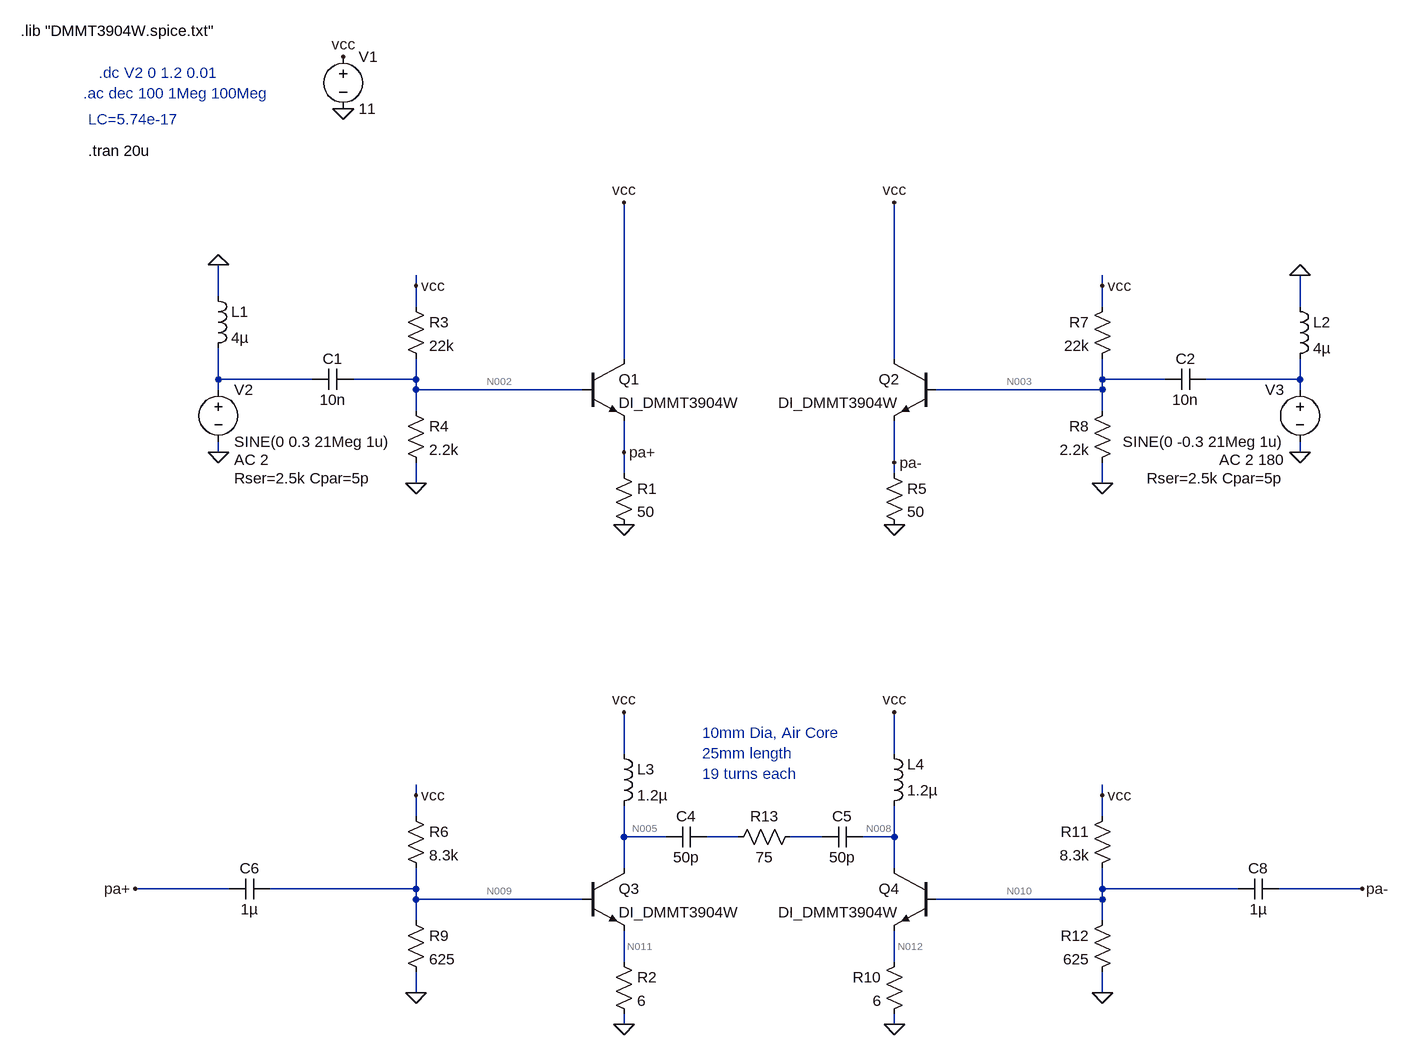
[diagram p0: schematic Output.asc]
Output.asc, the LTspice schematic file:
Version 4.1
SHEET 1 4292 2340
WIRE -128 -16 -128 -32
WIRE 928 -16 928 -32
WIRE -432 0 -432 -48
WIRE -128 16 -128 -16
WIRE 928 16 928 -16
WIRE 1232 16 1232 -32
WIRE 192 96 192 -144
WIRE 608 96 608 -144
WIRE -432 128 -432 80
WIRE -288 128 -432 128
WIRE -128 128 -128 96
WIRE -128 128 -224 128
WIRE 928 128 928 96
WIRE 1024 128 928 128
WIRE 1232 128 1232 96
WIRE 1232 128 1088 128
WIRE -432 144 -432 128
WIRE -128 144 -128 128
WIRE 128 144 -128 144
WIRE 928 144 928 128
WIRE 928 144 672 144
WIRE 1232 144 1232 128
WIRE -128 176 -128 144
WIRE 928 176 928 144
WIRE -432 240 -432 224
WIRE 192 240 192 192
WIRE 1232 240 1232 224
WIRE 608 256 608 192
WIRE 192 272 192 240
WIRE 608 272 608 256
WIRE -128 288 -128 256
WIRE 928 288 928 256
WIRE 192 704 192 640
WIRE 608 704 608 640
WIRE -128 768 -128 752
WIRE 928 768 928 752
WIRE -128 800 -128 768
WIRE 928 800 928 768
WIRE 192 832 192 784
WIRE 256 832 192 832
WIRE 368 832 320 832
WIRE 496 832 448 832
WIRE 608 832 608 784
WIRE 608 832 560 832
WIRE 192 880 192 832
WIRE 608 880 608 832
WIRE -416 912 -560 912
WIRE -128 912 -128 880
WIRE -128 912 -352 912
WIRE 928 912 928 880
WIRE 1136 912 928 912
WIRE 1328 912 1200 912
WIRE -128 928 -128 912
WIRE 128 928 -128 928
WIRE 928 928 928 912
WIRE 928 928 672 928
WIRE -128 960 -128 928
WIRE 928 960 928 928
WIRE 192 1024 192 976
WIRE 608 1024 608 976
WIRE -128 1072 -128 1040
WIRE 928 1072 928 1040
WIRE 192 1120 192 1104
WIRE 608 1120 608 1104
FLAG -240 -288 0
FLAG -432 240 0
FLAG -240 -368 vcc
FLAG -128 288 0
FLAG -128 -16 vcc
FLAG 192 -144 vcc
FLAG 1232 240 0
FLAG 928 288 0
FLAG 928 -16 vcc
FLAG 608 -144 vcc
FLAG 192 352 0
FLAG 608 352 0
FLAG -432 -48 0
FLAG 1232 -32 0
FLAG 192 1120 0
FLAG -128 1072 0
FLAG -128 768 vcc
FLAG 192 640 vcc
FLAG 608 1120 0
FLAG 928 1072 0
FLAG 928 768 vcc
FLAG 608 640 vcc
FLAG -560 912 pa+
FLAG 192 240 pa+
FLAG 608 256 pa-
FLAG 1328 912 pa-
SYMBOL npn 128 96 R0
SYMATTR InstName Q1
SYMATTR Value DI_DMMT3904W
SYMBOL voltage -240 -384 R0
WINDOW 123 0 0 Left 0
WINDOW 39 0 0 Left 0
SYMATTR InstName V1
SYMATTR Value 11
SYMBOL voltage -432 128 R0
WINDOW 123 24 124 Left 2
WINDOW 39 24 152 Left 2
SYMATTR Value2 AC 2
SYMATTR SpiceLine Rser=2.5k Cpar=5p
SYMATTR InstName V2
SYMATTR Value SINE(0 0.3 21Meg 1u)
SYMBOL cap -224 112 R90
WINDOW 0 0 32 VBottom 2
WINDOW 3 32 32 VTop 2
SYMATTR InstName C1
SYMATTR Value 10n
SYMBOL res -144 0 R0
SYMATTR InstName R3
SYMATTR Value 22k
SYMBOL res -144 160 R0
SYMATTR InstName R4
SYMATTR Value 2.2k
SYMBOL npn 672 96 M0
SYMATTR InstName Q2
SYMATTR Value DI_DMMT3904W
SYMBOL voltage 1232 128 M0
WINDOW 123 24 124 Left 2
WINDOW 39 24 152 Left 2
SYMATTR Value2 AC 2 180
SYMATTR SpiceLine Rser=2.5k Cpar=5p
SYMATTR InstName V3
SYMATTR Value SINE(0 -0.3 21Meg 1u)
SYMBOL cap 1024 112 M90
WINDOW 0 0 32 VBottom 2
WINDOW 3 32 32 VTop 2
SYMATTR InstName C2
SYMATTR Value 10n
SYMBOL res 944 0 M0
SYMATTR InstName R7
SYMATTR Value 22k
SYMBOL res 944 160 M0
SYMATTR InstName R8
SYMATTR Value 2.2k
SYMBOL res 176 256 R0
SYMATTR InstName R1
SYMATTR Value 50
SYMBOL res 592 256 R0
SYMATTR InstName R5
SYMATTR Value 50
SYMBOL ind -448 -16 R0
SYMATTR InstName L1
SYMATTR Value 4µ
SYMATTR SpiceLine Rser=6.5
SYMBOL ind 1216 0 R0
SYMATTR InstName L2
SYMATTR Value 4µ
SYMATTR SpiceLine Rser=6.5
SYMBOL npn 128 880 R0
SYMATTR InstName Q3
SYMATTR Value DI_DMMT3904W
SYMBOL res 176 1008 R0
SYMATTR InstName R2
SYMATTR Value 6
SYMBOL res -144 784 R0
SYMATTR InstName R6
SYMATTR Value 8.3k
SYMBOL res -144 944 R0
SYMATTR InstName R9
SYMATTR Value 625
SYMBOL ind 176 688 R0
SYMATTR InstName L3
SYMATTR Value 1.2µ
SYMATTR SpiceLine Rser=2.23
SYMBOL npn 672 880 M0
SYMATTR InstName Q4
SYMATTR Value DI_DMMT3904W
SYMBOL res 624 1008 M0
SYMATTR InstName R10
SYMATTR Value 6
SYMBOL res 944 784 M0
SYMATTR InstName R11
SYMATTR Value 8.3k
SYMBOL res 944 944 M0
SYMATTR InstName R12
SYMATTR Value 625
SYMBOL ind 592 800 M180
WINDOW 0 36 80 Left 2
WINDOW 3 36 40 Left 2
SYMATTR InstName L4
SYMATTR Value 1.2µ
SYMATTR SpiceLine Rser=2.23
SYMBOL res 464 816 R90
WINDOW 0 0 56 VBottom 2
WINDOW 3 32 56 VTop 2
SYMATTR InstName R13
SYMATTR Value 75
SYMBOL cap 320 816 R90
WINDOW 0 0 32 VBottom 2
WINDOW 3 32 32 VTop 2
SYMATTR InstName C4
SYMATTR Value 50p
SYMBOL cap 560 816 R90
WINDOW 0 0 32 VBottom 2
WINDOW 3 32 32 VTop 2
SYMATTR InstName C5
SYMATTR Value 50p
SYMBOL cap -352 896 R90
WINDOW 0 0 32 VBottom 2
WINDOW 3 32 32 VTop 2
SYMATTR InstName C6
SYMATTR Value 1µ
SYMBOL cap 1136 896 M90
WINDOW 0 0 32 VBottom 2
WINDOW 3 32 32 VTop 2
SYMATTR InstName C8
SYMATTR Value 1µ
TEXT -736 -408 Left 2 !.lib "DMMT3904W.spice.txt"
TEXT -616 -344 Left 2 ;.dc V2 0 1.2 0.01
TEXT -640 -312 Left 2 ;.ac dec 100 1Meg 100Meg
TEXT -632 -272 Left 2 ;LC=5.74e-17
TEXT -632 -224 Left 2 !.tran 20u
TEXT 312 672 Left 2 ;10mm Dia, Air Core\n25mm length\n19 turns each

The netlist it stands for:
* Output.asc
Q1 vcc N002 pa+ 0 DI_DMMT3904W
V1 vcc 0 11
V2 N001 0 SINE(0 0.3 21Meg 1u) AC 2 Rser=2.5k Cpar=5p
C1 N002 N001 10n
R3 vcc N002 22k
R4 N002 0 2.2k
Q2 vcc N003 pa- 0 DI_DMMT3904W
V3 N004 0 SINE(0 -0.3 21Meg 1u) AC 2 180 Rser=2.5k Cpar=5p
C2 N003 N004 10n
R7 vcc N003 22k
R8 N003 0 2.2k
R1 pa+ 0 50
R5 pa- 0 50
L1 0 N001 4µ Rser=6.5
L2 0 N004 4µ Rser=6.5
Q3 N005 N009 N011 0 DI_DMMT3904W
R2 N011 0 6
R6 vcc N009 8.3k
R9 N009 0 625
L3 vcc N005 1.2µ Rser=2.23
Q4 N008 N010 N012 0 DI_DMMT3904W
R10 N012 0 6
R11 vcc N010 8.3k
R12 N010 0 625
L4 N008 vcc 1.2µ Rser=2.23
R13 N007 N006 75
C4 N006 N005 50p
C5 N008 N007 50p
C6 N009 pa+ 1µ
C8 N010 pa- 1µ
.model NPN NPN
.model PNP PNP
.lib standard.bjt
.lib "DMMT3904W.spice.txt"
* .dc V2 0 1.2 0.01
* .ac dec 100 1Meg 100Meg
* LC=5.74e-17
.tran 20u
* 10mm Dia, Air Core
* 25mm length
* 19 turns each
.backanno
.end

* Results of the author's LTspice run, read from the files saved beside the schematic
* Operating Point, zero values left out:
*   V(n002) = 951.1 mV
*   V(n003) = 951.1 mV
*   V(n005) = 10.98 V
*   V(n008) = 10.98 V
*   V(n009) = 748.1 mV
*   V(n010) = 748.1 mV
*   V(n011) = 48.56 mV
*   V(n012) = 48.56 mV
*   V(pa+) = 265.9 mV
*   V(pa-) = 265.9 mV
*   V(vcc) = 11 V
*   I(L3) = 8.054 mA
*   I(L4) = -8.054 mA
*   I(R1) = 5.317 mA
*   I(R10) = 8.093 mA
*   I(R11) = 1.235 mA
*   I(R12) = 1.197 mA
*   I(R2) = 8.093 mA
*   I(R3) = 456.8 µA
*   I(R4) = 432.3 µA
*   I(R5) = 5.317 mA
*   I(R6) = 1.235 mA
*   I(R7) = 456.8 µA
*   I(R8) = 432.3 µA
*   I(R9) = 1.197 mA
*   I(V1) = -30.08 mA
*   Ib(Q1) = 24.43 µA
*   Ib(Q2) = 24.43 µA
*   Ib(Q3) = 38.19 µA
*   Ib(Q4) = 38.19 µA
*   Ic(Q1) = 5.293 mA
*   Ic(Q2) = 5.293 mA
*   Ic(Q3) = 8.054 mA
*   Ic(Q4) = 8.054 mA
*   Ie(Q1) = -5.317 mA
*   Ie(Q2) = -5.317 mA
*   Ie(Q3) = -8.093 mA
*   Ie(Q4) = -8.093 mA
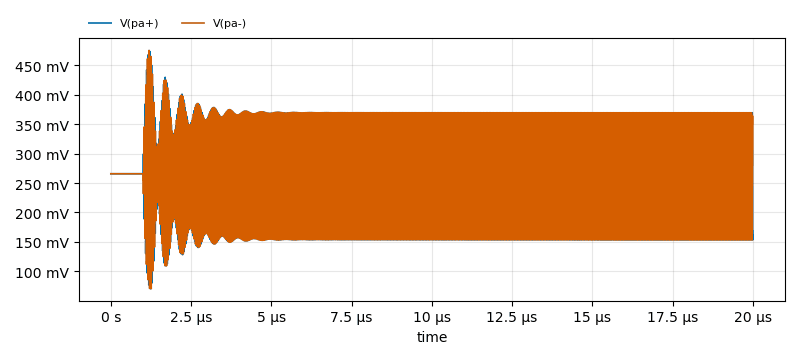
[diagram p1: Transient Analysis of Output.asc, plotted from the saved traces]
* Transient Analysis, 1 run:
*   V(pa+): min 70.29 mV, max 473.6 mV, average 268.3 mV, rms 277.9 mV, last 162.1 mV
*   V(pa-): min 70.56 mV, max 475.6 mV, average 268.3 mV, rms 277.9 mV, last 363.3 mV